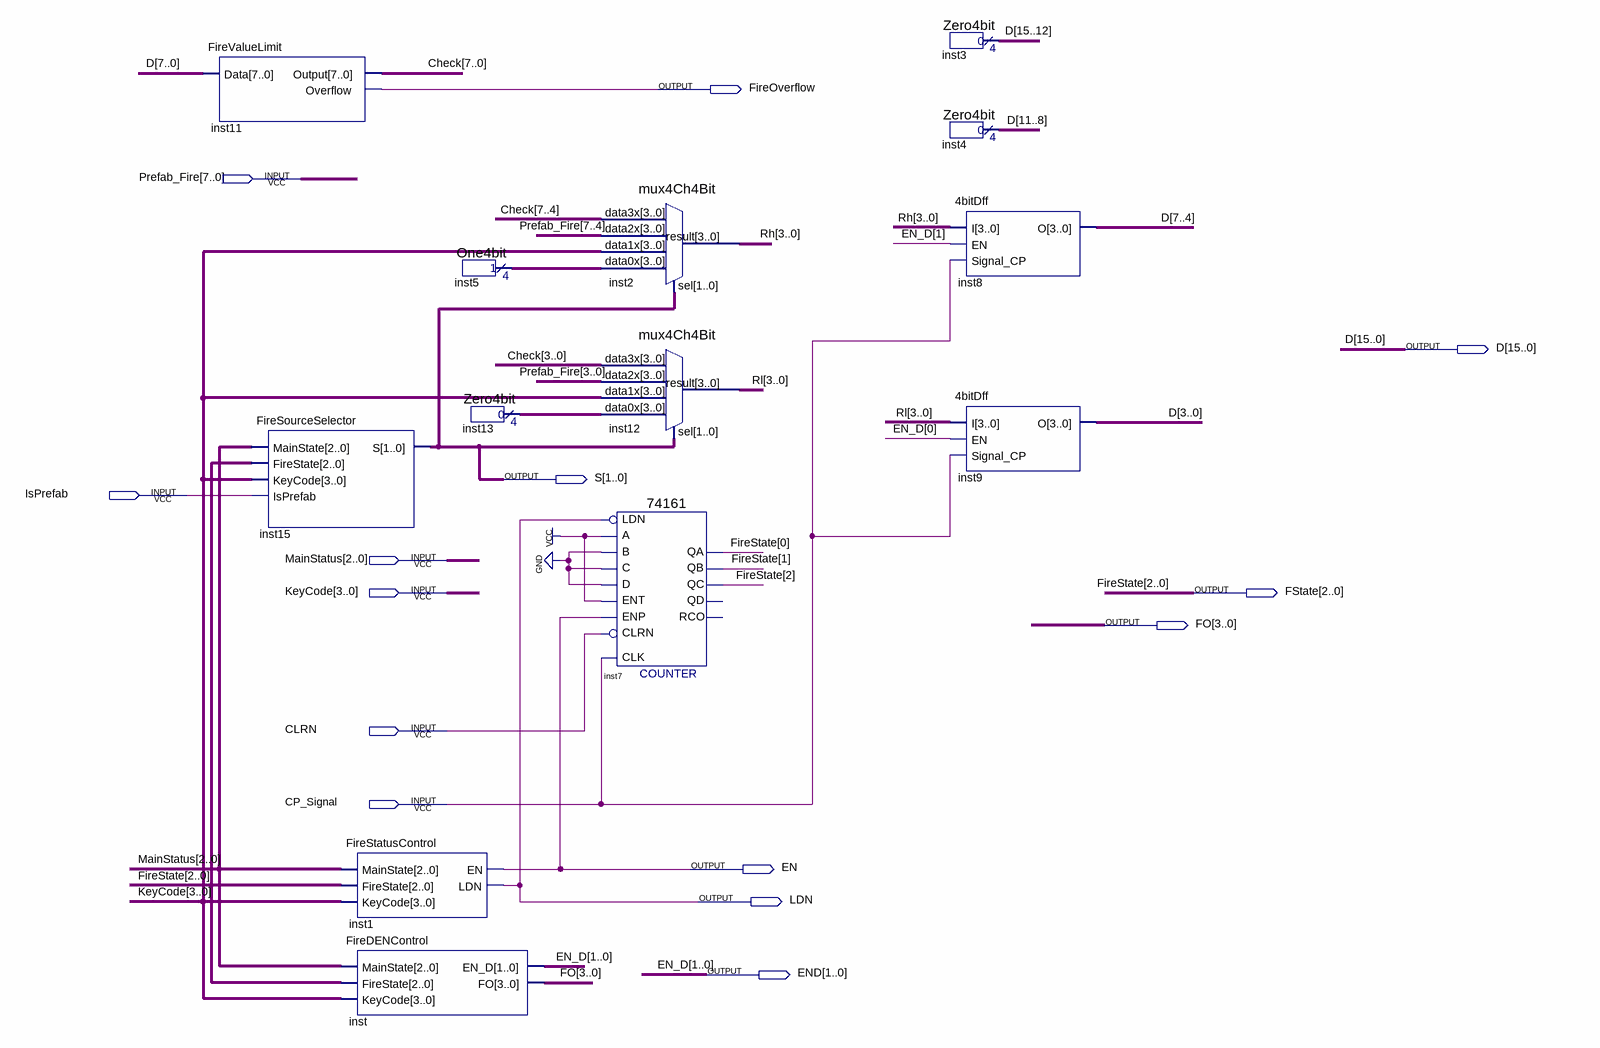
[diagram p0: schematic sheet]
// Quartus schematic FireStatus_test.bdf as structural Verilog: 13 symbols, 14 pins
module FireStatus_test (
  input  [7:0] Prefab_Fire,
  input  IsPrefab,
  input  [2:0] MainStatus,
  input  [3:0] KeyCode,
  input  CLRN,
  input  CP_Signal,
  output FireOverflow,
  output [15:0] D,
  output [1:0] S,
  output [2:0] FState,
  output [3:0] FO,
  output EN,
  output LDN,
  output [1:0] END
);

  wire [3:0] inst5_result, inst13_result, Rh, Rl;
  wire [7:0] Check;

  FireValueLimit inst11 (.Data(D[7:0]), .Output(Check), .Overflow(FireOverflow));
  FireSourceSelector inst15 (.MainState(MainStatus), .FireState(FState), .KeyCode(KeyCode), .IsPrefab(IsPrefab), .S(S));
  FireStatusControl inst1 (.MainState(MainStatus), .FireState(FState), .KeyCode(KeyCode), .EN(EN), .LDN(LDN));
  FireDENControl inst (.MainState(MainStatus), .FireState(FState), .KeyCode(KeyCode), .EN_D(END), .FO(FO));
  One4bit inst5 (.result(inst5_result));
  Zero4bit inst13 (.result(inst13_result));
  mux4Ch4Bit inst2 (
    .data3x(Check[7:4]), .data2x(Prefab_Fire[7:4]), .data1x(KeyCode), .data0x(inst5_result), .sel(S),
    .result(Rh));
  mux4Ch4Bit inst12 (
    .data3x(Check[3:0]), .data2x(Prefab_Fire[3:0]), .data1x(KeyCode), .data0x(inst13_result), .sel(S),
    .result(Rl));
  \74161  inst7 (
    .CLRN(CLRN), .CLK(CP_Signal), .ENP(EN), .LDN(LDN), .A(1'b1), .D(1'b0), .ENT(1'b1), .B(1'b0), .C(1'b0),
    .QC(FState[2]), .QB(FState[1]), .QA(FState[0]));  // open: QD, RCO
  Zero4bit inst3 (.result(D[15:12]));
  Zero4bit inst4 (.result(D[11:8]));
  \4bitDff  inst8 (.I(Rh), .EN(END[1]), .Signal_CP(CP_Signal), .O(D[7:4]));
  \4bitDff  inst9 (.I(Rl), .EN(END[0]), .Signal_CP(CP_Signal), .O(D[3:0]));

  // Other names for the same wires on the sheet: EN_D[1:0] = END; FireState[2:0] = FState
endmodule
